# Altium schematic sheet MCU_STM32_L496ZGT6.SchDoc
size A4; SheetNumber: 3; SheetTotal: 10
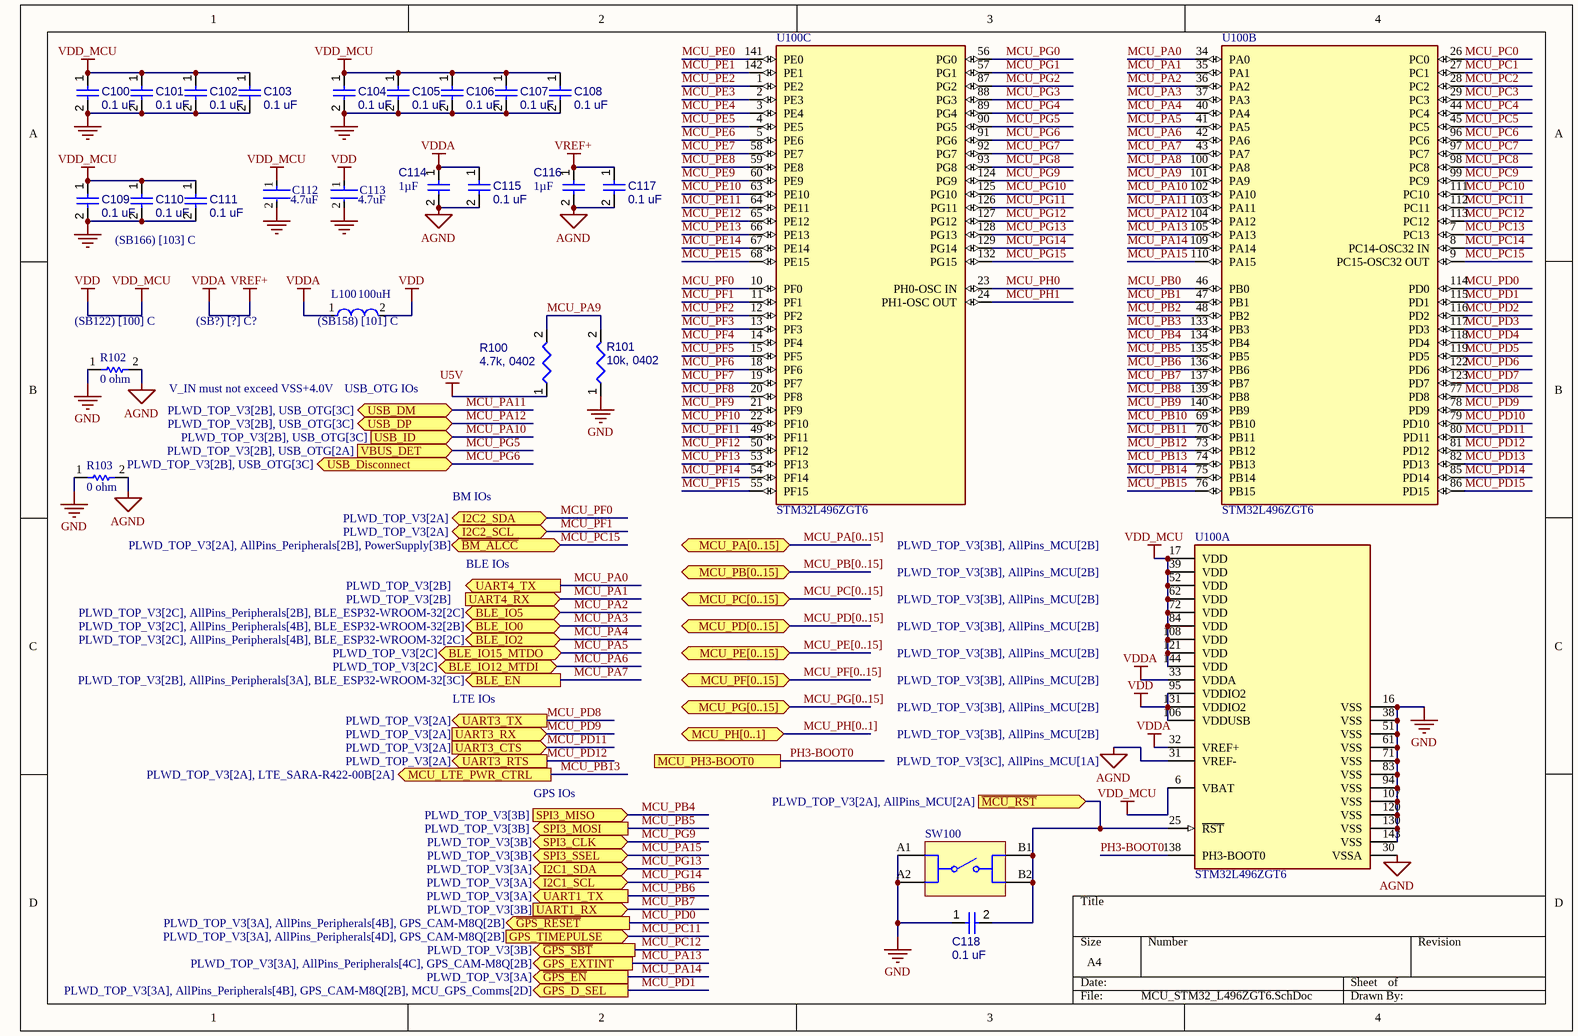
[diagram p0: MCU_STM32_L496ZGT6.SchDoc]

## Parts
C100  0.1 uF  [CAPC1005X56X25LL10T15]
C101  0.1 uF  [CAPC1005X56X25LL10T15]
C102  0.1 uF  [CAPC1005X56X25LL10T15]
C103  0.1 uF  [CAPC1005X56X25LL10T15]
C104  0.1 uF  [CAPC1005X56X25LL10T15]
C105  0.1 uF  [CAPC1005X56X25LL10T15]
C106  0.1 uF  [CAPC1005X56X25LL10T15]
C107  0.1 uF  [CAPC1005X56X25LL10T15]
C108  0.1 uF  [CAPC1005X56X25LL10T15]
C109  0.1 uF  [CAPC1005X56X25LL10T15]
C110  0.1 uF  [CAPC1005X56X25LL10T15]
C111  0.1 uF  [CAPC1005X56X25LL10T15]
C112  Capacitance: 4.7uF  [FP-CL282-IPC_C]  (hidden comment: CL05A475MP5NRNC)
C113  Capacitance: 4.7uF  [FP-CL282-IPC_C]  (hidden comment: CL05A475MP5NRNC)
C114  value 1µF  [CAPC0402(1005)60_L]  (hidden comment: Capacitor 1µF +/-20% 10V 0402)
C115  0.1 uF  [CAPC1005X56X25LL10T15]
C116  value 1µF  [CAPC0402(1005)60_L]  (hidden comment: Capacitor 1µF +/-20% 10V 0402)
C117  0.1 uF  [CAPC1005X56X25LL10T15]
C118  0.1 uF  [CAPC1005X56X25LL10T15]
L100  100uH  [FP-MLZ2012-1_25-IPC_C]
R100  4.7k, 0402  [RESC0402(1005)_L]
R101  10k, 0402  [RESC1005X40X25ML05T05]
R102  0 ohm  [RESC1005X40X25LL05T10]
R103  0 ohm  [RESC1005X40X25LL05T10]
SW100  430182070816  [WS-TASV_L6W6H7_4301x20708x6]  (value not drawn)
U100  STM32L496ZGT6  [FP-LQFP144-1A-MFG]  (parts A,B,C of 3)

## Ports
BLE_EN (out, see PLWD_TOP_V3[2B], AllPins_Peripherals[3A], BLE_ESP32-WROOM-32[3C]), BLE_IO0 (bidir, see PLWD_TOP_V3[2C], AllPins_Peripherals[4B], BLE_ESP32-WROOM-32[2B]), BLE_IO2 (bidir, see PLWD_TOP_V3[2C], AllPins_Peripherals[4B], BLE_ESP32-WROOM-32[2C]), BLE_IO5 (bidir, see PLWD_TOP_V3[2C], AllPins_Peripherals[2B], BLE_ESP32-WROOM-32[2C]), BLE_IO12_MTDI (bidir, see PLWD_TOP_V3[2C]), BLE_IO15_MTDO (bidir, see PLWD_TOP_V3[2C]), GPS_D_SEL (out, see PLWD_TOP_V3[3A], AllPins_Peripherals[4B], GPS_CAM-M8Q[2B], MCU_GPS_Comms[2D]), GPS_EXTINT (out, see PLWD_TOP_V3[3A], AllPins_Peripherals[4C], GPS_CAM-M8Q[2B]), GPS_TIMEPULSE (in, see PLWD_TOP_V3[3A], AllPins_Peripherals[4D], GPS_CAM-M8Q[2B]), I2C1_SCL (bidir, see PLWD_TOP_V3[3A]), I2C1_SDA (bidir, see PLWD_TOP_V3[3A]), I2C2_SCL (bidir, see PLWD_TOP_V3[2A]), I2C2_SDA (bidir, see PLWD_TOP_V3[2A]), MCU_LTE_PWR_CTRL (out, see PLWD_TOP_V3[2A], LTE_SARA-R422-00B[2A]), MCU_PA[0..15] (bidir, see PLWD_TOP_V3[3B], AllPins_MCU[2B]), MCU_PB[0..15] (bidir, see PLWD_TOP_V3[3B], AllPins_MCU[2B]), MCU_PC[0..15] (bidir, see PLWD_TOP_V3[3B], AllPins_MCU[2B]), MCU_PD[0..15] (bidir, see PLWD_TOP_V3[3B], AllPins_MCU[2B]), MCU_PE[0..15] (bidir, see PLWD_TOP_V3[3B], AllPins_MCU[2B]), MCU_PF[0..15] (bidir, see PLWD_TOP_V3[3B], AllPins_MCU[2B]), MCU_PG[0..15] (bidir, see PLWD_TOP_V3[3B], AllPins_MCU[2B]), MCU_PH3-BOOT0 (see PLWD_TOP_V3[3C], AllPins_MCU[1A]), MCU_PH[0..1] (bidir, see PLWD_TOP_V3[3B], AllPins_MCU[2B]), SPI3_CLK (bidir, see PLWD_TOP_V3[3B]), SPI3_MISO (in, see PLWD_TOP_V3[3B]), SPI3_MOSI (out, see PLWD_TOP_V3[3B]), SPI3_SSEL (bidir, see PLWD_TOP_V3[3B]), UART1_RX (in, see PLWD_TOP_V3[3B]), UART1_TX (out, see PLWD_TOP_V3[3A]), UART3_CTS (in, see PLWD_TOP_V3[2A]), UART3_RTS (out, see PLWD_TOP_V3[2A]), UART3_RX (in, see PLWD_TOP_V3[2A]), UART3_TX (out, see PLWD_TOP_V3[2A]), UART4_RX (in, see PLWD_TOP_V3[2B]), UART4_TX (out, see PLWD_TOP_V3[2B]), USB_Disconnect (bidir, see PLWD_TOP_V3[2B], USB_OTG[3C]), USB_DM (bidir, see PLWD_TOP_V3[2B], USB_OTG[3C]), USB_DP (bidir, see PLWD_TOP_V3[2B], USB_OTG[3C]), USB_ID (in, see PLWD_TOP_V3[2B], USB_OTG[3C]), VBUS_DET (in, see PLWD_TOP_V3[2B], USB_OTG[2A]), ~{BM_ALCC} (bidir, see PLWD_TOP_V3[2A], AllPins_Peripherals[2B], PowerSupply[3B]), ~{GPS_EN} (out, see PLWD_TOP_V3[3A]), ~{GPS_RESET} (out, see PLWD_TOP_V3[3A], AllPins_Peripherals[4B], GPS_CAM-M8Q[2B]), ~{GPS_SBT} (out, see PLWD_TOP_V3[3B]), ~{MCU_RST} (in, see PLWD_TOP_V3[2A], AllPins_MCU[2A])

## Nets
AGND: C114.2 C115.2 C116.2 C117.2 R102.2 R103.2 U100.30(VSSA) U100.31(VREF-)
GND: C100.2 C101.2 C102.2 C103.2 C104.2 C105.2 C106.2 C107.2 C108.2 C109.2 C110.2 C111.2 C112.2 C113.2 C118.1 R101.1 R102.1 R103.1 SW100.A1 SW100.A2 U100.16(VSS) U100.38(VSS) U100.51(VSS) U100.61(VSS) U100.71(VSS) U100.83(VSS) U100.94(VSS) U100.107(VSS) U100.120(VSS) U100.130(VSS) U100.143(VSS)
U5V: R100.1
VDD: C100.1 C101.1 C102.1 C103.1 C104.1 C105.1 C106.1 C107.1 C108.1 C109.1 C110.1 C111.1 C112.1 C113.1 L100.2 U100.6(VBAT) U100.17(VDD) U100.39(VDD) U100.52(VDD) U100.62(VDD) U100.72(VDD) U100.84(VDD) U100.95(VDDIO2) U100.106(VDDUSB) U100.108(VDD) U100.121(VDD) U100.131(VDDIO2) U100.144(VDD)  [also labelled VDD_MCU]
VDDA: C114.1 C115.1 C116.1 C117.1 L100.1 U100.32(VREF+) U100.33(VDDA)  [also labelled VREF+]
~{MCU_RST}: C118.2 SW100.B1 SW100.B2 U100.25(~{RST}) ; port ~{MCU_RST}
MCU_PA0: U100.34(PA0) ; port UART4_TX
MCU_PA1: U100.35(PA1) ; port UART4_RX
MCU_PA2: U100.36(PA2) ; port BLE_IO5
MCU_PA3: U100.37(PA3) ; port BLE_IO0
MCU_PA4: U100.40(PA4) ; port BLE_IO2
MCU_PA5: U100.41(PA5) ; port BLE_IO15_MTDO
MCU_PA6: U100.42(PA6) ; port BLE_IO12_MTDI
MCU_PA7: U100.43(PA7) ; port BLE_EN
MCU_PA8: U100.100(PA8)
MCU_PA9: R100.2 R101.2 U100.101(PA9)
MCU_PA10: U100.102(PA10) ; port USB_ID
MCU_PA11: U100.103(PA11) ; port USB_DM
MCU_PA12: U100.104(PA12) ; port USB_DP
MCU_PA13: U100.105(PA13) ; port GPS_EXTINT
MCU_PA14: U100.109(PA14) ; port ~{GPS_EN}
MCU_PA15: U100.110(PA15) ; port SPI3_SSEL
MCU_PB0: U100.46(PB0)
MCU_PB1: U100.47(PB1)
MCU_PB2: U100.48(PB2)
MCU_PB3: U100.133(PB3)
MCU_PB4: U100.134(PB4) ; port SPI3_MISO
MCU_PB5: U100.135(PB5) ; port SPI3_MOSI
MCU_PB6: U100.136(PB6) ; port UART1_TX
MCU_PB7: U100.137(PB7) ; port UART1_RX
MCU_PB8: U100.139(PB8)
MCU_PB9: U100.140(PB9)
MCU_PB10: U100.69(PB10)
MCU_PB11: U100.70(PB11)
MCU_PB12: U100.73(PB12)
MCU_PB13: U100.74(PB13) ; port MCU_LTE_PWR_CTRL
MCU_PB14: U100.75(PB14)
MCU_PB15: U100.76(PB15)
MCU_PC0: U100.26(PC0)
MCU_PC1: U100.27(PC1)
MCU_PC2: U100.28(PC2)
MCU_PC3: U100.29(PC3)
MCU_PC4: U100.44(PC4)
MCU_PC5: U100.45(PC5)
MCU_PC6: U100.96(PC6)
MCU_PC7: U100.97(PC7)
MCU_PC8: U100.98(PC8)
MCU_PC9: U100.99(PC9)
MCU_PC10: U100.111(PC10)
MCU_PC11: U100.112(PC11) ; port GPS_TIMEPULSE
MCU_PC12: U100.113(PC12) ; port ~{GPS_SBT}
MCU_PC13: U100.7(PC13)
MCU_PC14: U100.8(PC14-OSC32_IN)
MCU_PC15: U100.9(PC15-OSC32_OUT) ; port ~{BM_ALCC}
MCU_PD0: U100.114(PD0) ; port ~{GPS_RESET}
MCU_PD1: U100.115(PD1) ; port GPS_D_SEL
MCU_PD2: U100.116(PD2)
MCU_PD3: U100.117(PD3)
MCU_PD4: U100.118(PD4)
MCU_PD5: U100.119(PD5)
MCU_PD6: U100.122(PD6)
MCU_PD7: U100.123(PD7)
MCU_PD8: U100.77(PD8) ; port UART3_TX
MCU_PD9: U100.78(PD9) ; port UART3_RX
MCU_PD10: U100.79(PD10)
MCU_PD11: U100.80(PD11) ; port UART3_CTS
MCU_PD12: U100.81(PD12) ; port UART3_RTS
MCU_PD13: U100.82(PD13)
MCU_PD14: U100.85(PD14)
MCU_PD15: U100.86(PD15)
MCU_PE0: U100.141(PE0)
MCU_PE1: U100.142(PE1)
MCU_PE2: U100.1(PE2)
MCU_PE3: U100.2(PE3)
MCU_PE4: U100.3(PE4)
MCU_PE5: U100.4(PE5)
MCU_PE6: U100.5(PE6)
MCU_PE7: U100.58(PE7)
MCU_PE8: U100.59(PE8)
MCU_PE9: U100.60(PE9)
MCU_PE10: U100.63(PE10)
MCU_PE11: U100.64(PE11)
MCU_PE12: U100.65(PE12)
MCU_PE13: U100.66(PE13)
MCU_PE14: U100.67(PE14)
MCU_PE15: U100.68(PE15)
MCU_PF0: U100.10(PF0) ; port I2C2_SDA
MCU_PF1: U100.11(PF1) ; port I2C2_SCL
MCU_PF2: U100.12(PF2)
MCU_PF3: U100.13(PF3)
MCU_PF4: U100.14(PF4)
MCU_PF5: U100.15(PF5)
MCU_PF6: U100.18(PF6)
MCU_PF7: U100.19(PF7)
MCU_PF8: U100.20(PF8)
MCU_PF9: U100.21(PF9)
MCU_PF10: U100.22(PF10)
MCU_PF11: U100.49(PF11)
MCU_PF12: U100.50(PF12)
MCU_PF13: U100.53(PF13)
MCU_PF14: U100.54(PF14)
MCU_PF15: U100.55(PF15)
MCU_PG0: U100.56(PG0)
MCU_PG1: U100.57(PG1)
MCU_PG2: U100.87(PG2)
MCU_PG3: U100.88(PG3)
MCU_PG4: U100.89(PG4)
MCU_PG5: U100.90(PG5) ; port VBUS_DET
MCU_PG6: U100.91(PG6) ; port USB_Disconnect
MCU_PG7: U100.92(PG7)
MCU_PG8: U100.93(PG8)
MCU_PG9: U100.124(PG9) ; port SPI3_CLK
MCU_PG10: U100.125(PG10)
MCU_PG11: U100.126(PG11)
MCU_PG12: U100.127(PG12)
MCU_PG13: U100.128(PG13) ; port I2C1_SDA
MCU_PG14: U100.129(PG14) ; port I2C1_SCL
MCU_PG15: U100.132(PG15)
MCU_PH0: U100.23(PH0-OSC_IN)
MCU_PH1: U100.24(PH1-OSC_OUT)
PH3-BOOT0: U100.138(PH3-BOOT0) ; port MCU_PH3-BOOT0

## Buses and harness runs
bus MCU_PA[0..15] = port MCU_PA[0..15]
bus MCU_PB[0..15] = port MCU_PB[0..15]
bus MCU_PC[0..15] = port MCU_PC[0..15]
bus MCU_PD[0..15] = port MCU_PD[0..15]
bus MCU_PE[0..15] = port MCU_PE[0..15]
bus MCU_PF[0..15] = port MCU_PF[0..15]
bus MCU_PG[0..15] = port MCU_PG[0..15]
bus MCU_PH[0..1] = port MCU_PH[0..1]

## Notes on the sheet
- (SB166) [103] C
- (near R102) (SB122) [100] C
- (SB?) [?] C?
- (near L100) (SB158) [101] C
- V_IN must not exceed VSS+4.0V
- USB_OTG IOs
- BM IOs
- BLE IOs
- LTE IOs
- GPS IOs

## Library data of the parts
C100-C111 C115 C117 C118 = CMP-001-00001-6: Chip Capacitor, 0.1 uF, +/- 5%, 16 V, 0402 (1005 Metric); Value: 100nF; Capacitor Type: Ceramic; Voltage Rating: 16V; Min Operating Temperature: -55°C; Pins: 2; Case/Package: 0402; Max Operating Temperature: 125°C; Mounting Technology: SM; RoHS Compliant: True; Tolerance: 5%
C112 C113 = CMP-13271-000548-1: Cap Ceramic 4.7uF 10V X5R ±20% SMD 0402 +85°C Paper T/R; Max Operating Temperature: 85°C; Lead Free: Lead Free; Tolerance: 20%; Voltage Rating: 10V; Dielectric: X5R; Width: 0.02inch; Length: 0.039inch; Case/Package: 0402; Min Operating Temperature: -55°C; Packaging: Tape and Reel; Thickness: 0.022inch; Case Code (Imperial): 0402; Package Quantity: 10000; Case Code (Metric): 1005; Mount: Surface Mount
C114 C116 = CMP-001-00063-3: Chip Capacitor, 1µF +/-20%, 10V, 0402, Thickness 0.6 mm; Tolerance: 10%; Mounting Technology: SMT; Max Operating Temperature: 85°C; Voltage Rating: 10V; Pins: 2; Case/Package: 0402; Min Operating Temperature: -55°C
L100 = CMP-08253-000224-1: (MLZ2012N101LT000) / Shielded Multilayer Inductor 100uH ±20% 140mA 4550mΩ SMD 0805; Saturation Current: 30mA; DC Resistance (DCR): 4.55R; Test Frequency: 2MHz; Resistance: 3.5R; Core Material: Ferrite; Max Operating Temperature: 125°C; Shielding: Shielded; RoHS Compliant: Yes; Width: 0.049inch; Inductance: 100uH; Current Rating: 140mA; Lead Free: Lead Free; Case Code (Metric): 2012; Mount: Surface Mount; Case Code (Imperial): 0805; Length: 0.079inch; Tolerance: 20%; Packaging: Tape and Reel; Case/Package: 0805; Height - Seated (Max): 0.057inch; Min Operating Temperature: -55°C; Package Quantity: 2000
R100 = CMP-009-00158-3: Chip Resistor, 4,7 kOhms, +/-1 %, 63 mW, -55 to 155 degC, 0402; Power: 63mW; Tolerance: 1%; Max Operating Temperature: 155°C; Pins: 2; Value: 4.7k; Min Operating Temperature: -55°C; Case/Package: 0402
R101 = CMP-009-00015-5: Chip Resistor, 10 KOhm, +/- 1%, 0.1 W, -55 to 155 degC, 0402 (1005 Metric); Voltage Rating: 50V; Power: 100mW; Case/Package: 0402; Value: 10k; RoHS Compliant: True; Min Operating Temperature: -55°C; Mounting Technology: SM; Tolerance: 1%; Max Operating Temperature: 155°C; Pins: 2
R102 R103 = CMP-2002-06455-1: Manufacturer: Panasonic; Part Number: ERJ-S020R00X
SW100 = CMP-1452-00015-2: NexarPartId: 22866492; Actuator Length: 3.6mm; Actuator Material: Liquid Crystal Polymer, Polymer; Contact Current Rating: 50mA; Contact Resistance: 100mΩ; Illumination Type: Illuminated, Non-Illuminated; Life (Cycles): 1Mcycles; Switch Function: Off-Mom; Switch Travel: 250µm; Throw Configuration: SPST; Voltage Rating (DC): 12V; Color: Black; Contact Material: Stainless Steel, Steel; Contact Plating: Silver; Current Rating: 50mA; Diameter: 3mm; Height: 7mm; Insulation Resistance: 100MΩ; Lead Free: Lead Free; Length: 6.2mm; Max Operating Temperature: 85°C; Mechanical Life: 1Mcycles; Min Operating Temperature: -40°C; Mount: Surface Mount; Packaging: Tape and Reel; REACH SVHC: No SVHC; RoHS: Compliant; Termination: Gull Wing; Voltage Rating: 12V; Width: 6.2mm
U100 = CMP-12105-000038-1: IC MCU 32BIT 1MB FLASH 144LQFP; Manufacturer: STMicroelectronics; Max Supply Voltage: 3.6V; Core Architecture: ARM Cortex-M4; Data Bus Width: 32bits; Number Of I2C Channels: 4; Standoff Height: 0.05mm; Max Junction Temp: +105°C; Number Of I/Os: 115; Number Of Pwm Channels: 28; Number Of Spi Channels: 3; Min Supply Voltage: 1.05V; Number Of Adc Channels: 24; Interface: I2C,SPI,UART,USART,CAN,USB,LIN,IrDA,I2S,Other; Number Of Timers/Counters: 13; Ram Size: 320KBytes; Frequency: 80MHz; Number Of Usb Channels: 1; Number Of Uart Channels: 6; Memory Size: 1MBytes; Temperature: -40°C to +105°C; Category: IC; ComponentLink2URL: https://www.st.com/resource/en/datasheet/stm32l496zg.pdf; Device Class L2: Embedded Processors and Controllers; Automotive: No; Device Class L3: Microcontrollers; Digikey Description: IC MCU 32BIT 1MB FLASH 144LQFP; Device Class L1: Integrated Circuits (ICs); Ambient Temperature Range High: +85°C; Ambient Temperature Range Low: -40°C; Temperature Range Low: -40°C; ComponentLink2Description: Datasheet; Package: LQFP144-1A; Manufacturer Part Number: STM32L496ZGT6; Octopart: https://octopart.com/stm32l496zgt6-stmicroelectronics-80927210; Number Of Cores: 1; Height: 1.6mm; Memory Type: FLASH; Lead Free: Yes; Temperature Range High: +105°C; RoHS: TRUE; Number Of A/D Converters: 3; Ipc Land Pattern Name: QFP50P2200X2200X160-144